# EAGLE design Tweetronic_Base (EAGLE 7.1.0)
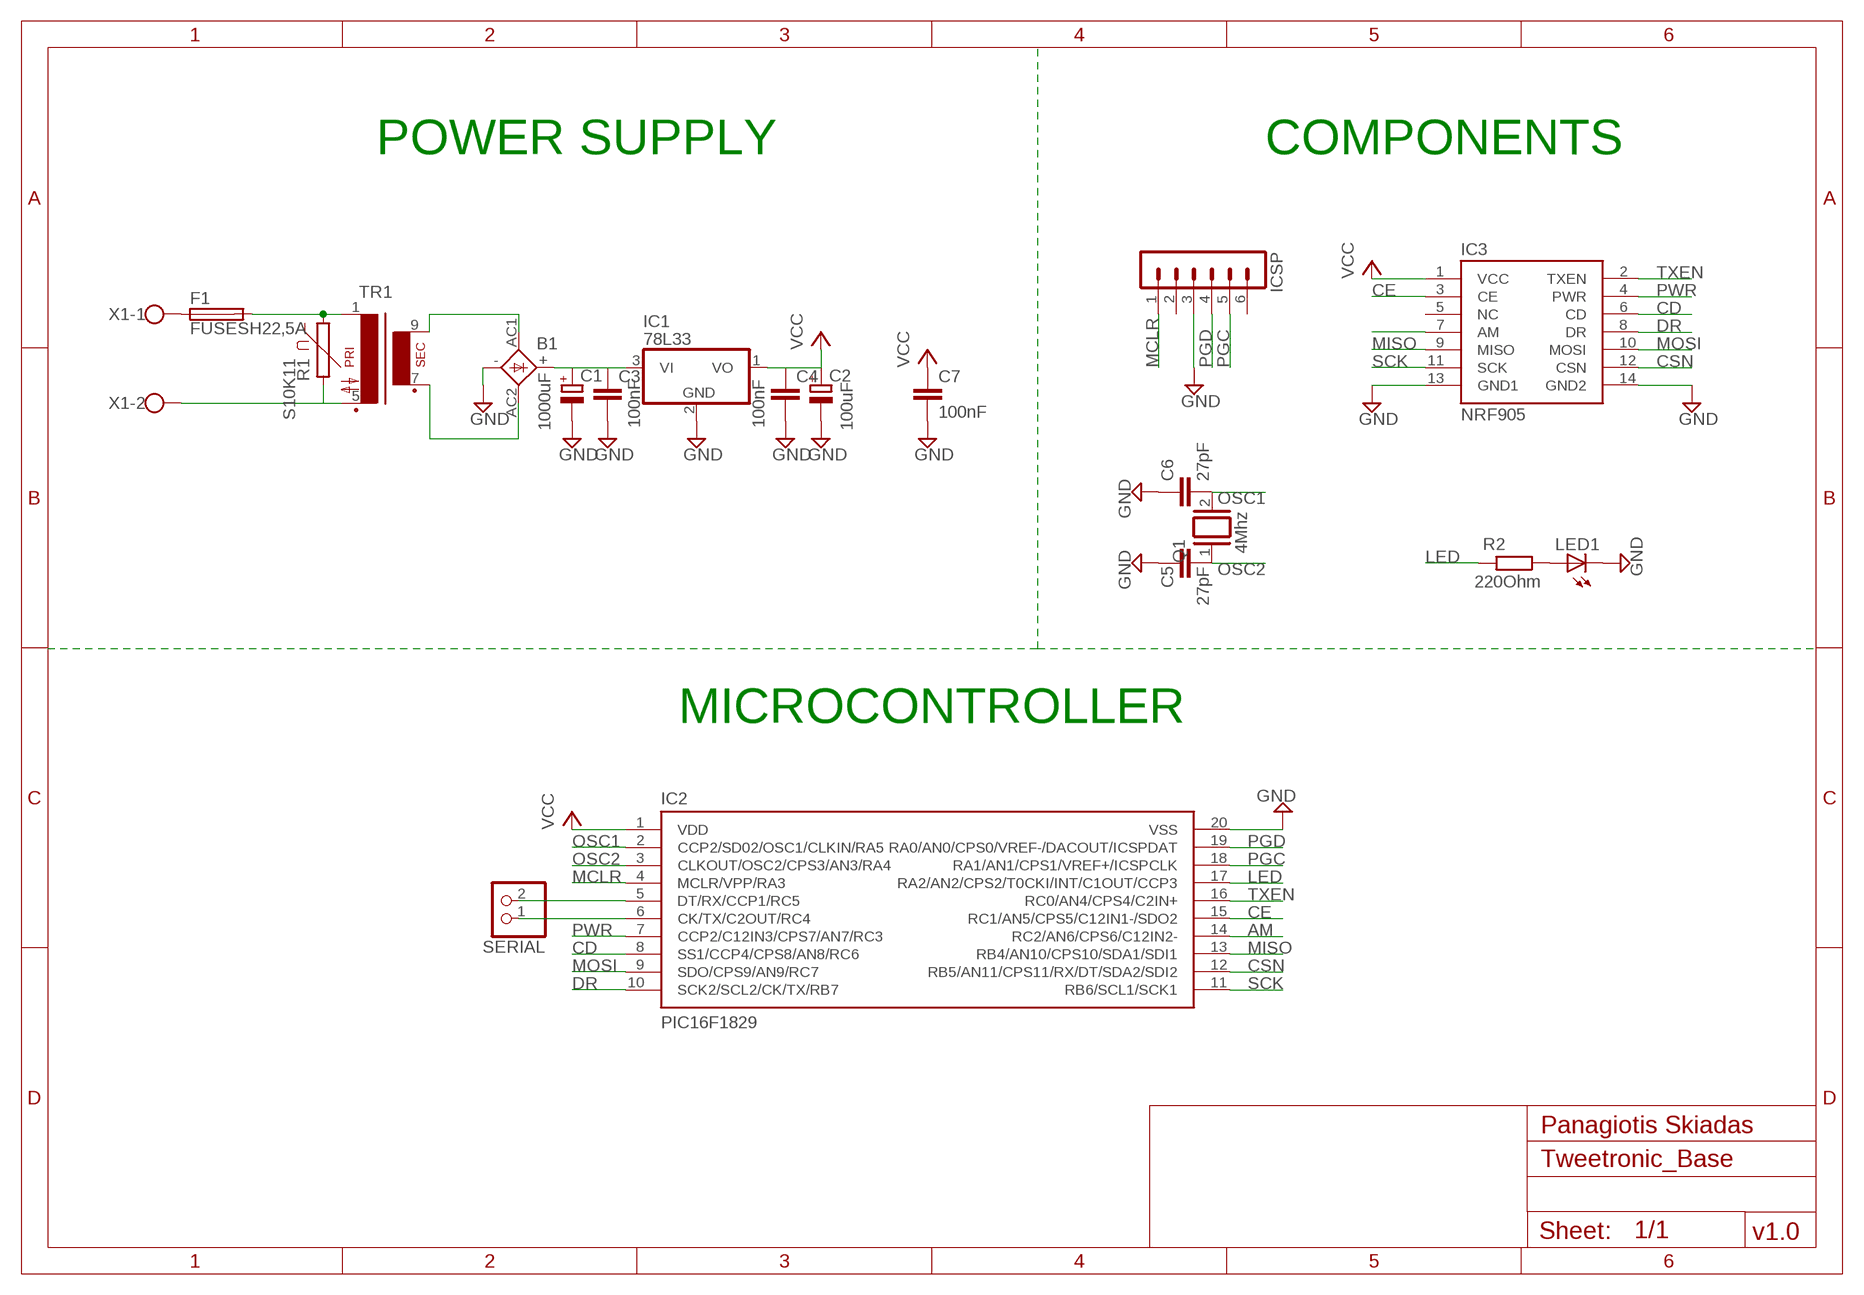
[diagram p0: schematic, sheet 1]

## Parts
B1  1KAB  [1KAB]
C1  1000uF  CPOL-EUE5-13  [E5-13]
C2  100uF  CPOL-EUE3.5-8  [E3,5-8]
C3  100nF  C5/3  [C5B3]
C4  100nF  C5/3  [C5B3]
C5  27pF  C2,5-3  [C2.5-3]
C6  27pF  C2,5-3  [C2.5-3]
C7  100nF  C5/3  [C5B3]
F1  FUSESH22,5A  [SH22,5A]
IC1  78L33  78L05Z  [TO92]
IC2  PIC16F1829  [DIL20]
IC3  NRF905  [2X07]
ICSP  MA06-1  [MA06-1]
LED1  LED5MM  [LED5MM]
Q1  4Mhz  XTAL/S  [QS]
R1  S10K11  [S10K11]
R2  220Ohm  R-EU_0207/10  [0207/10]
SERIAL  PINHD-1X2  [1X02]
TR1  VR11  [VR11]
X1  W237-102  [W237-102]

## Nets
AM: IC2.14(RC2/AN6/CPS6/C12IN2-) IC3.7(AM)
CD: IC2.8(SS1/CCP4/CPS8/AN8/RC6) IC3.6(CD)
CE: IC2.15(RC1/AN5/CPS5/C12IN1-/SDO2) IC3.3(CE)
CSN: IC2.12(RB5/AN11/CPS11/RX/DT/SDA2/SDI2) IC3.12(CSN)
DR: IC2.10(SCK2/SCL2/CK/TX/RB7) IC3.8(DR)
GND: B1.- C1.- C2.- C3.2 C4.2 C5.1 C6.1 C7.2 IC1.2(GND) IC2.20(VSS) IC3.13(GND1) IC3.14(GND2) ICSP.3 LED1.K(C)
LED: IC2.17(RA2/AN2/CPS2/T0CKI/INT/C1OUT/CCP3) R2.2
MCLR: IC2.4(MCLR/VPP/RA3) ICSP.1
MISO: IC2.13(RB4/AN10/CPS10/SDA1/SDI1) IC3.9(MISO)
MOSI: IC2.9(SDO/CPS9/AN9/RC7) IC3.10(MOSI)
N$1: F1.1 X1.1
N$2: F1.2 R1.1 TR1.1
N$3: R1.2 TR1.5(P2) X1.2
N$4: B1.AC1 TR1.9(S4)
N$5: B1.AC2 TR1.7(S3)
N$6: B1.+ C1.+ C3.1 IC1.3(VI)
N$7: IC2.5(DT/RX/CCP1/RC5) SERIAL.2
N$8: IC2.6(CK/TX/C2OUT/RC4) SERIAL.1
N$9: LED1.A R2.1
OSC1: C6.2 IC2.2(CCP2/SD02/OSC1/CLKIN/RA5) Q1.2
OSC2: C5.2 IC2.3(CLKOUT/OSC2/CPS3/AN3/RA4) Q1.1
PGC: IC2.18(RA1/AN1/CPS1/VREF+/ICSPCLK) ICSP.5
PGD: IC2.19(RA0/AN0/CPS0/VREF-/DACOUT/ICSPDAT) ICSP.4
PWR: IC2.7(CCP2/C12IN3/CPS7/AN7/RC3) IC3.4(PWR)
SCK: IC2.11(RB6/SCL1/SCK1) IC3.11(SCK)
TXEN: IC2.16(RC0/AN4/CPS4/C2IN+) IC3.2(TXEN)
VCC: C2.+ C4.1 C7.1 IC1.1(VO) IC2.1(VDD) IC3.1(VCC)
Unconnected: IC3.5(NC) ICSP.2 ICSP.6

## Notes on the sheet
- POWER SUPPLY | COMPONENTS
- MICROCONTROLLER
- Panagiotis Skiadas
- v1.0

## Library data of the parts
B1 = rectifier:1KAB: RECTIFIER grid 5,08 x 5,08 mm
C1 C2 = rcl:CPOL-EU: POLARIZED CAPACITOR, European symbol
C3-C7 = capacitor-wima:C: CAPACITOR naming: grid - package width
F1 = fuse:FUSE: Fuse; OC_FARNELL: unknown; OC_NEWARK: unknown
IC1 = 78L33:78*: Positive VOLTAGE REGULATOR Source: http://cache.national.com/ds/LM/LM78L05.pdf http://www.fairchildsemi.com/ds/LM/LM7805.pdf
IC2 = pic16f1829:PIC16F1829
IC3 = nrf905:NRF905
ICSP = con-lstb:MA06-1: PIN HEADER; OC_FARNELL: unknown; OC_NEWARK: unknown
LED1 = led:LED: LED OSRAM: - CHIPLED LG R971, LG N971, LY N971, LG Q971, LY Q971, LO R971, LY R971 LH N974, LH R974 LS Q976, LO Q976, LY Q976 LO Q996 - Hyper CHIPLED LW Q18S LB Q993, LB Q99A, LB R99A - SideLED LS A670, LO A670, LY A670, LG A670, LP A670 LB A673, LV A673, LT A673, LW A673 LH A674 LY A675 LS A676, LA A676, LO A676, LY A676, LW A676 LS A679, LY A679, LG A679 - Hyper Micro SIDELED® LS Y876, LA Y876, LO Y876, LY Y876 LT Y87S - SmartLED LW L88C, LW L88S LB L89C, LB L89S, LG L890 LS L89K, LO L89K, LY L89K LS L896, LA L896, LO L896, LY L896 - TOPLED LS T670, LO T670, LY T670, LG T670, LP T670 LSG T670, LSP T670, LSY T670, LOP T670, LYG T670 LG T671, LOG T671, LSG T671 LB T673, LV T673, LT T673, LW T673 LH T674 LS T676, LA T676, LO T676, LY T676, LB T676, LH T676, LSB T676, LW T676 LB T67C, LV T67C, LT T67C, LS T67K, LO T67K, LY T67K, LW E67C LS E67B, LA E67B, LO E67B, LY E67B, LB E67C, LV E67C, LT E67C LW T67C LS T679, LY T679, LG T679 LS T770, LO T770, LY T770, LG T770, LP T770 LB T773, LV T773, LT T773, LW T773 LH T774 LS E675, LA E675, LY E675, LS T675 LS T776, LA T776, LO T776, LY T776, LB T776 LHGB T686 LT T68C, LB T68C - Hyper Mini TOPLED® LB M676 - Mini TOPLED Santana® LG M470 LS M47K, LO M47K, LY M47K Source: http://www.osram.convergy.de LUXEON: - LUMILED® LXK2-PW12-R00, LXK2-PW12-S00, LXK2-PW14-U00, LXK2-PW14-V00 LXK2-PM12-R00, LXK2-PM12-S00, LXK2-PM14-U00 LXK2-PE12-Q00, LXK2-PE12-R00, LXK2-PE12-S00, LXK2-PE14-T00, LXK2-PE14-U00 LXK2-PB12-K00, LXK2-PB12-L00, LXK2-PB12-M00, LXK2-PB14-N00, LXK2-PB14-P00, LXK2-PB14-Q00 LXK2-PR12-L00, LXK2-PR12-M00, LXK2-PR14-Q00, LXK2-PR14-R00 LXK2-PD12-Q00, LXK2-PD12-R00, LXK2-PD12-S00 LXK2-PH12-R00, LXK2-PH12-S00 LXK2-PL12-P00, LXK2-PL12-Q00, LXK2-PL12-R00 Source: www.luxeon.com KINGBRIGHT: KA-3528ASYC Source: www.kingbright.com
Q1 = special:XTAL/S: CRYSTAL
R1 = varistor:S10K11: VARISTOR
R2 = rcl:R-EU_: RESISTOR, European symbol
SERIAL = pinhead:PINHD-1X2: PIN HEADER
TR1 = mini_transformer:VR11: TRANSFORMER 1 primary winding, 1 secondary winding BLOCK
X1 = con-wago-500:W237-102: WAGO SCREW CLAMP; MPN: 237-102; OC_FARNELL: unknown; OC_NEWARK: 70K9898

## Board
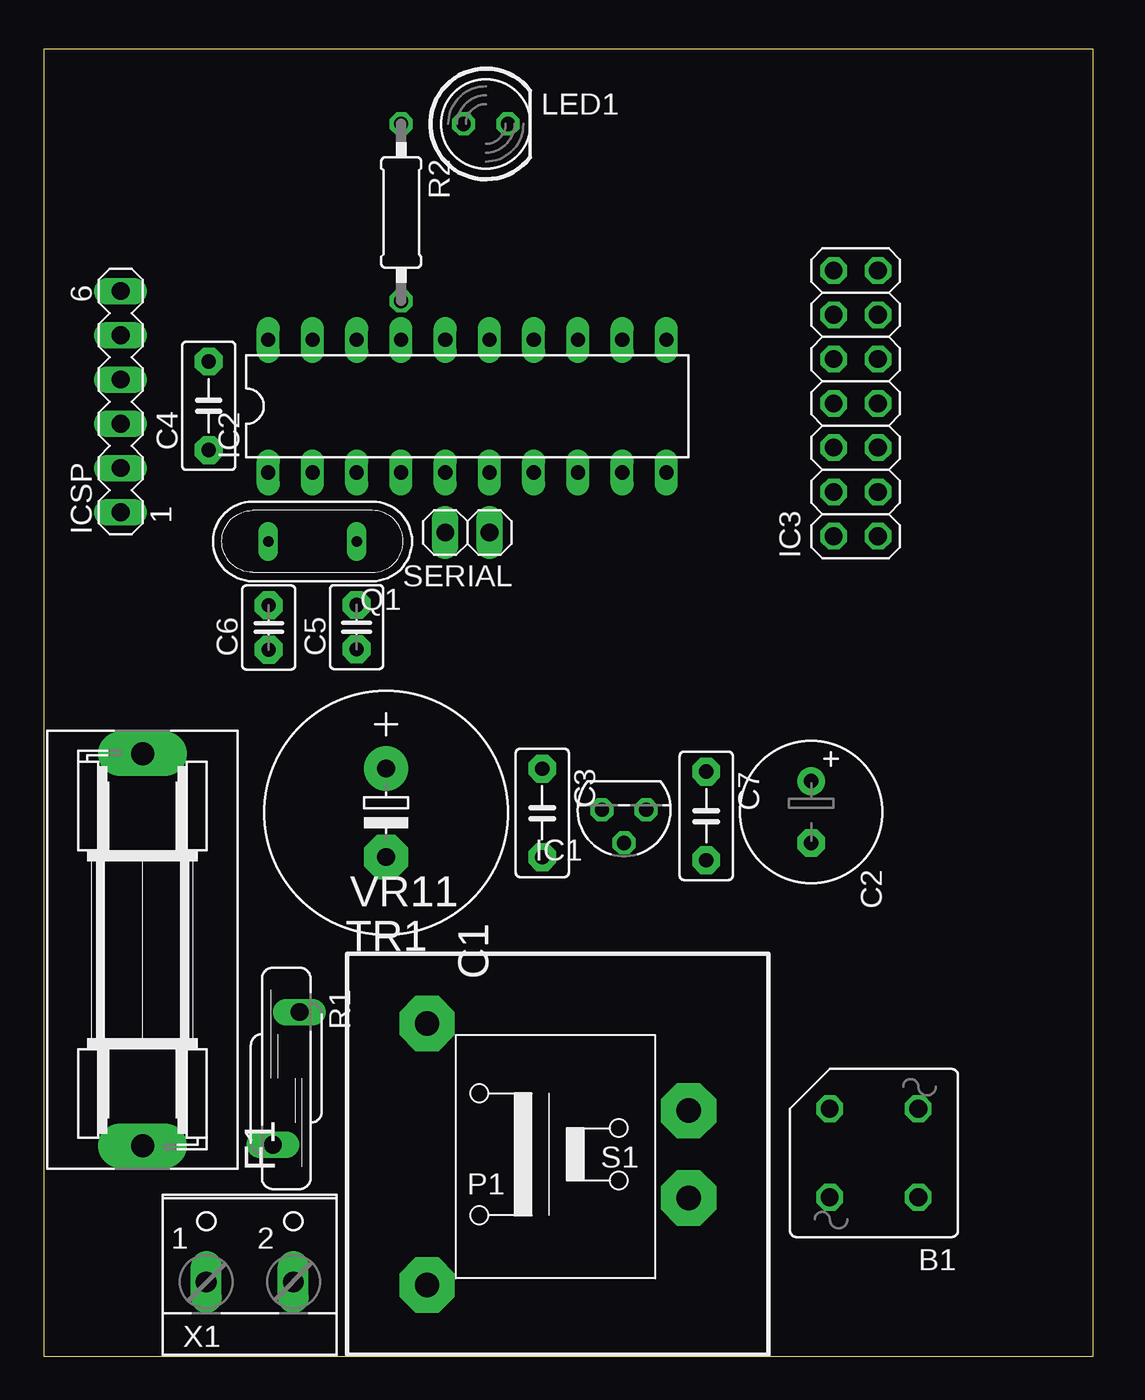
[diagram p1: board, top side]
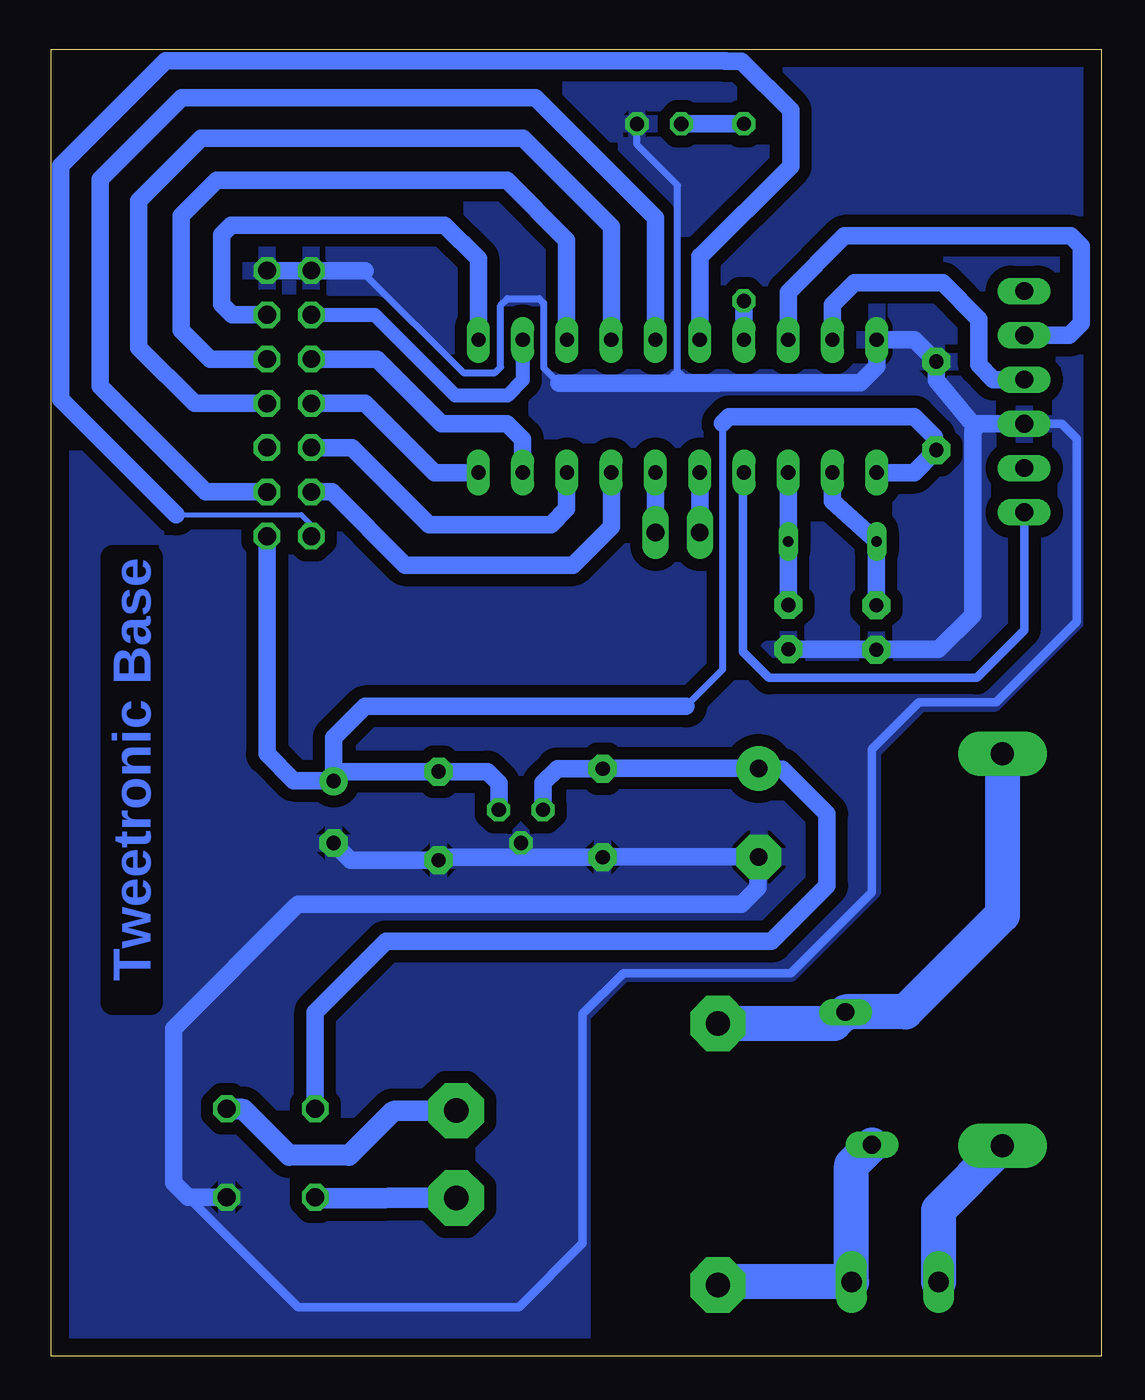
[diagram p2: board, bottom side, seen from below]

Size 60.28 x 75 mm. Coordinates in mm from the lower left corner, seen from the top.
Outline: 0,0 60.28,0 60.28,75 0,75 0,0
Copper layers (1*16): Top 0.035mm / dielectric 1.5mm / Bottom 0.035mm
Design rules "default": minimum track width 10mil, minimum drill 24mil, track to track 8mil, track to pad 8mil, pad to pad 8mil, via to via 8mil, smd to smd 8mil, copper to edge 40mil, drill to drill 8mil, minimum pad ring 10mil, minimum via ring 8mil, stop-mask expansion 4mil, vias tented up to drill 0mil, thermal gap 10mil

### Footprints (pad centres in the part's own frame; a part is rotated, then mirrored left to right if it is on the bottom)
1KAB = drill 1.016 octagon: + 2.54,-2.54; - -2.54,2.54; AC1 -2.54,-2.54; AC2 2.54,2.54
E5-13 = drill 1.016 pad 2.54: + -2.54,0 | drill 1.016 pad 2.54 octagon: - 2.54,0
E3,5-8 = drill 0.813 pad 1.6: + -1.778,0 | drill 0.813 pad 1.6 octagon: - 1.778,0
C5B3 = drill 0.813 pad 1.6 octagon: 1 -2.54,0; 2 2.54,0
C2.5-3 = drill 0.813 pad 1.6 octagon: 1 -1.27,0; 2 1.27,0
SH22,5A = drill 1.321 pad 2.54 long: 1 -11.252,0; 2 11.252,0
TO92 = drill 0.813 octagon: 1 -1.27,0; 2 0,1.905; 3 1.27,0
DIL20 = drill 0.813 long: 1 -11.43,-3.81; 2 -8.89,-3.81; 3 -6.35,-3.81; 4 -3.81,-3.81; 5 -1.27,-3.81; 6 1.27,-3.81; 7 3.81,-3.81; 8 6.35,-3.81; 9 8.89,-3.81; 10 11.43,-3.81; 11 11.43,3.81; 12 8.89,3.81; 13 6.35,3.81; 14 3.81,3.81; 15 1.27,3.81; 16 -1.27,3.81; 17 -3.81,3.81; 18 -6.35,3.81; 19 -8.89,3.81; 20 -11.43,3.81
2X07 = drill 1.016 octagon: 1 -7.62,-1.27; 2 -7.62,1.27; 3 -5.08,-1.27; 4 -5.08,1.27; 5 -2.54,-1.27; 6 -2.54,1.27; 7 0,-1.27; 8 0,1.27; 9 2.54,-1.27; 10 2.54,1.27; 11 5.08,-1.27; 12 5.08,1.27; 13 7.62,-1.27; 14 7.62,1.27
MA06-1 = drill 1.016 long: 1 -6.35,0; 2 -3.81,0; 3 -1.27,0; 4 1.27,0; 5 3.81,0; 6 6.35,0
LED5MM = drill 0.813 octagon: A -1.27,0; K 1.27,0
QS = drill 0.61 long: 1 -2.54,0; 2 2.54,0
S10K11 = drill 1.016 long: 1 -0.762,-3.81; 2 0.762,3.81
0207/10 = drill 0.813 octagon: 1 -5.08,0; 2 5.08,0
1X02 = drill 1.016 long: 1 -1.27,0; 2 1.27,0
VR11 = drill 1.397 pad 3.175 octagon: 1 -8.008,7.008; 5 -8.008,-8.008; 7 7.008,-3.004; 9 7.008,2.004
W237-102 = drill 1.194 long: 1 -2.5,-1.27; 2 2.5,-1.27

### Placement (x,y rotation side)
B1  47.68,11.67 180 top
C1  19.67,31.2 270 top
C2  44.07,31.24 270 top
C3  28.63,31.19 270 top
C4  9.48,54.55 90 top
C5  17.97,41.85 90 top
C6  12.93,41.83 90 top
C7  38.04,31.02 270 top
F1  5.68,23.33 90 top
IC1  33.33,31.37 180 top
IC2  24.33,54.53 0 top
IC3  46.63,54.69 90 top
ICSP  4.43,54.79 90 top
LED1  25.39,70.72 0 top
Q1  15.44,46.77 180 top
R1  13.93,15.95 180 top
R2  20.53,65.65 270 top
SERIAL  24.33,47.28 180 top
TR1  30.02,12.1 0 top
X1  11.84,5.54 0 top

### Tracks (layer width: path | path; a pad name or v marks a point on that pad's centre or on a via)
AM
  Bottom 1: IC3.7 52.06,54.69 55.26,57.89 55.26,66.31 51.68,69.9 33.2,69.9 28.14,64.84 IC2.14
CD
  Bottom 1: IC3.6 43.02,52.15 38.6,47.73 31.61,47.73 30.69,48.64 30.69,50.71 IC2.8
CE
  Bottom 1: IC3.3 51.41,49.61 57.47,55.67 57.47,67.56 52.79,72.24 32.5,72.24 25.6,65.34 IC2.15
CSN
  Bottom 0.8: IC2.12 33.22,56.02 34.1,55.14 37.09,55.14 41.7,59.75 45.34,59.75 IC3.12
DR
  Bottom 1: IC2.10 38.29,50.72 42.26,54.69 IC3.8
GND
  Bottom 0.1: C5.1 9.42,40.58 7,43 7,53 7.46,53.47 4.5,53.47 ICSP.3
  Bottom 0.4: 24.33,56.15 24.33,67.19 26.66,69.52 LED1.K | 42.26,62.31 42.26,62.08 36.62,56.45 34.81,56.45 34.48,56.77 34.48,60.31 34.1,60.7 32.28,60.7 32.03,60.44 32.03,56.73 31.15,55.85
  Bottom 0.5: ICSP.3 2.26,53.53 1.41,52.67 1.41,42.15 5.5,38.05 6.03,37.53 10.48,37.53 13.16,34.85 13.16,26.65 17.81,22 27.45,22 29.78,19.67 29.78,6.48 33.44,2.82 46.12,2.82 53.18,9.87
  Bottom 1: ICSP.3 7,53.52 | 7,53.52 7.41,53.52 | 7.41,53.52 9.49,56.01 C4.2 10.73,58.34 IC2.20 12.9,56.82 13.84,55.88 22,55.88 | IC3.13 IC3.14 42.26,62.31 | 7.39,53.45 7.41,53.52 | 7,53.52 7.39,53.13 7.39,42.53 9.35,40.58 12.91,40.58 C6.1 12.95,40.58 C5.1 | 33,28.65 C3.2 28.62,28.66 C1.- 19.73,28.6 19.73,26.9 20.67,25.96 46.12,25.96 46.26,25.82 53.26,18.82 53.26,9.96 53.18,9.87 52.44,9.13 B1.- | 33,28.65 37.88,28.65 C7.2 43.09,28.48 C2.- | IC1.2 33.33,28.98 33,28.65 | 22,55.88 24.07,55.88 24.33,56.15 | 31.15,55.85 22.03,55.85 22,55.88
  pour Bottom (isolate 0.7): 0.03,75 60.32,75 60.32,-0.03 29.83,-0.03 29.83,19.48 29.83,19.59 27.42,22 17.84,22 13.14,26.69 13.14,34.73 10.39,37.49 6.16,37.49 0,43.65 0,75
LED
  Bottom 1: IC2.17 20.52,60.56 R2.2
MCLR
  Bottom 0.5: ICSP.1 4.43,41.67 7.16,38.94 19.09,38.94 20.58,40.44 20.58,50.66 IC2.4
MISO
  Bottom 1: IC3.9 51.15,57.23 52.82,58.9 52.82,65.46 50.78,67.5 34.13,67.5 30.69,64.06 30.69,58.35 IC2.13
MOSI
  Bottom 1: IC2.9 33.22,52.64 34.11,53.53 37.87,53.53 41.57,57.23 IC3.10
N$1
  Bottom 2: X1.1 9.34,8.42 F1.1
N$2
  Bottom 2: TR1.1 15.35,19.11 R1.1 14.69,19.77 11.25,19.77 5.68,25.34 F1.2
N$3
  Bottom 2: TR1.5 21.83,4.28 X1.2 14.34,10.97 R1.2
N$4
  Bottom 1.2: TR1.9 40.66,14.07 43.19,11.54 46.63,11.54 49.26,14.17 50.17,14.17 B1.AC1
N$5
  Bottom 1.2: TR1.7 45.06,9.06 B1.AC2
N$6
  Bottom 1: IC1.3 32.05,31.38 32.05,32.92 31.24,33.73 C3.1 28.62,33.74 C1.+ 19.63,33.71 18.32,33.71 15.75,31.14 15.75,27.01 18.94,23.82 41.07,23.82 45.14,19.76 B1.+
N$7
  Bottom 1: SERIAL.2 IC2.5
N$8
  Bottom 1: SERIAL.1 IC2.6
N$9
  Bottom 1: R2.1 LED1.A
N$10
  pour Bottom (isolate 0.7): 22,39 24,37 40,37 44,33 46,33 48,35 48,49 43,49 40,46 30,46 29,47 29,53 28,54 24,54 22,52
N$11
  pour Bottom (isolate 0.7): 0,75 21,75 21,74 18,71 18,68 23,63 23,57 0,57
N$12
  pour Bottom (isolate 0.7): 26,37 43,37 43,36 44,35 44,34 44,33 36,33 35,32 31,33 26,36
OSC1
  Bottom 1: C6.2 12.93,46.53 Q1.2 15.44,49.07 IC2.2
OSC2
  Bottom 1: IC2.3 Q1.1 17.97,46.53 C5.2
PGC
  Bottom 1: IC2.18 17.98,61.07 14.75,64.3 1.75,64.3 1.15,63.7 1.15,59.28 1.84,58.6 ICSP.5
PGD
  Bottom 1: ICSP.4 6.19,56.06 7.03,56.89 7.03,59.52 9.11,61.6 14.17,61.6 15.43,60.34 IC2.19
PWR
  Bottom 1: IC3.4 44.16,49.61 39.97,45.41 30.34,45.41 28.13,47.62 IC2.7
SCK
  Bottom 1: IC3.11 49.89,59.77 50.49,60.37 50.49,64.38 49.95,64.92 37.7,64.92 35.76,62.99 IC2.11
TXEN
  Bottom 0.3: 53.11,48.31 52.88,48.31 52.75,48.3 45.94,48.3 45.36,47.72 IC3.2
  Bottom 1: IC2.16 23.06,63.12 23.01,63.12 17.83,68.3 17.83,71.5 20.66,74.34 21.59,74.34 53.71,74.34 59.73,68.32 59.73,54.92 53.11,48.31
VCC
  Bottom 0.4: 21.75,53.56 21.75,39.41 23.85,37.31
  Bottom 1: C4.1 10.77,50.72 IC2.1 10.75,50.72 9.58,51.89 9.58,52.78 10.73,53.93 21.38,53.93 21.75,53.56 | IC1.1 34.59,31.38 34.59,32.9 35.25,33.56 C7.1 43.52,33.56 C2.+ | 23.85,37.31 42.27,37.31 44.07,35.51 C2.+ | IC3.1 47.9,34.58 46.37,33.05 44.1,33.05 C2.+

### Text on the board
Bottom: Tweetronic Base